# EAGLE schematic Domino Qi Mini No Teardrop (EAGLE 6.5.0)
Domino breakout Board
DATABASE: ./../Common/BOM/Domino_DB.txt; DRAWN: M.STEMPIN; REV: C
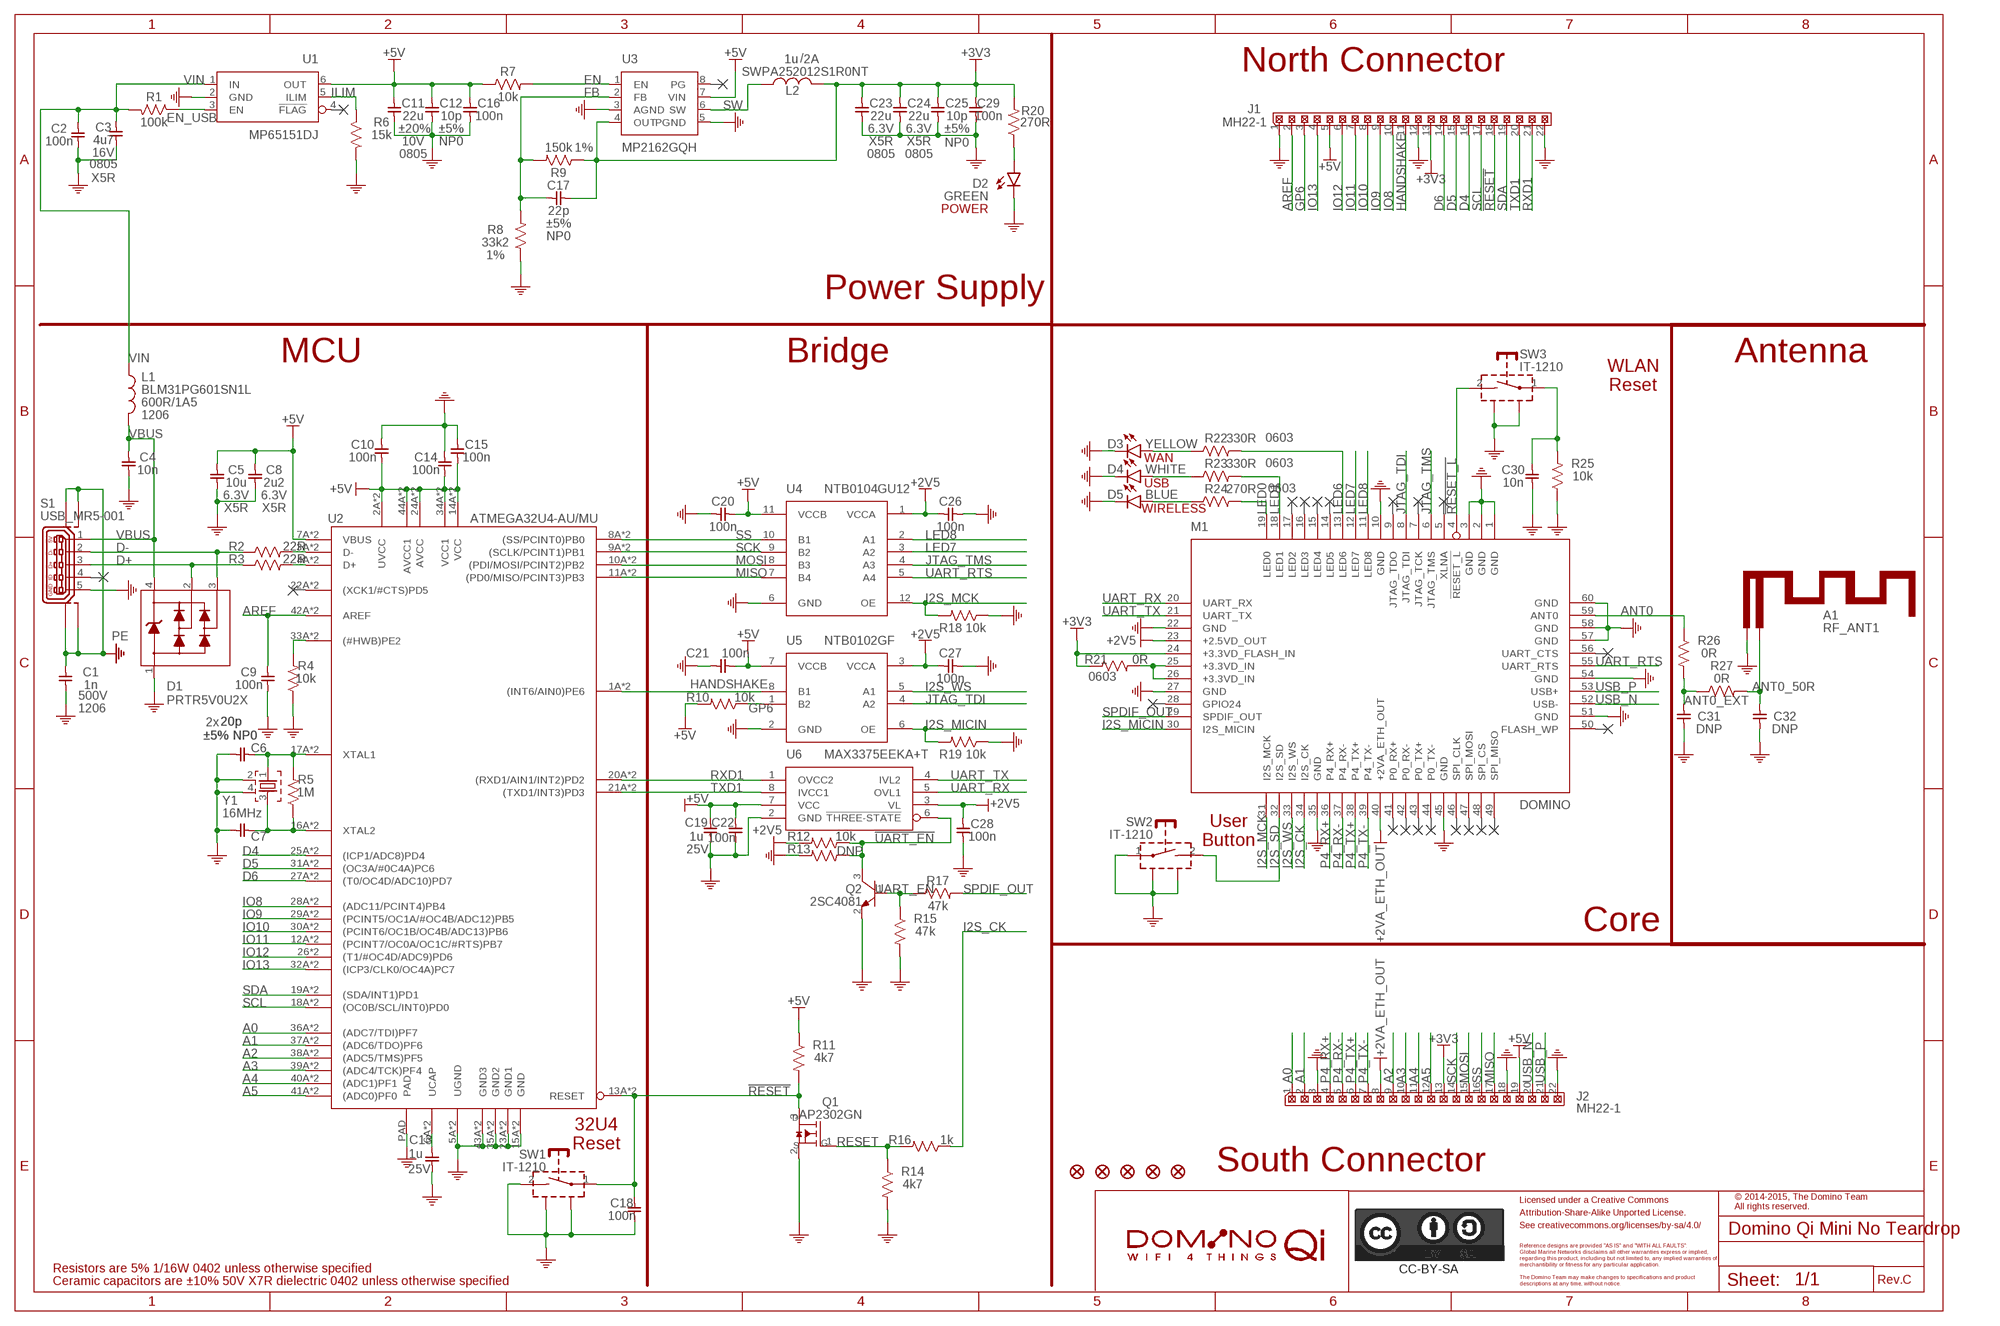
[diagram p0: schematic, sheet 1]
PORT1 (NC): BOM: EXCLUDE
PORT2 (NC): BOM: EXCLUDE
PORT3 (NC): BOM: EXCLUDE
PORT5 (NC): BOM: EXCLUDE
PORT6 (NC): BOM: EXCLUDE
PORT7 (NC): BOM: EXCLUDE
PORT8 (NC): BOM: EXCLUDE
PORT9 (NC): BOM: EXCLUDE
PORT10 (NC): BOM: EXCLUDE
PORT11 (NC): BOM: EXCLUDE
PORT12 (NC): BOM: EXCLUDE
PORT13 (NC): BOM: EXCLUDE
PORT14 (NC): BOM: EXCLUDE
PORT15 (NC): BOM: EXCLUDE
PORT16 (NC): BOM: EXCLUDE
PORT17 (NC): BOM: EXCLUDE
PORT18 (NC): BOM: EXCLUDE
PORT19 (NC): BOM: EXCLUDE
PORT20 (NC): BOM: EXCLUDE
PORT21 (NC): BOM: EXCLUDE
PORT22 (NC): BOM: EXCLUDE
PORT23 (NC): BOM: EXCLUDE

## Parts
A1  RF_ANT1  [RF_ANT1]
C1  1n  CAP_1206  [C1206]
C2  100n  CAP_0402  [C0402]
C3  4u7  CAP_0805  [C0805]
C4  10n  CAP_0402  [C0402]
C5  10u  CAP_0402  [C0402]
C6  20p  CAP_0402  [C0402]
C7  20p  CAP_0402  [C0402]
C8  2u2  CAP_0805  [C0805]
C9  100n  CAP_0402  [C0402]
C10  100n  CAP_0402  [C0402]
C11  22u  CAP_0805  [C0805]
C12  10p  CAP_0402  [C0402]
C13  1u  CAP_0402  [C0402]
C14  100n  CAP_0402  [C0402]
C15  100n  CAP_0402  [C0402]
C16  100n  CAP_0402  [C0402]
C17  22p  CAP_0402  [C0402]
C18  100n  CAP_0402  [C0402]
C19  1u  CAP_0402  [C0402]
C20  100n  CAP_0402  [C0402]
C21  100n  CAP_0402  [C0402]
C22  100n  CAP_0402  [C0402]
C23  22u  CAP_0805  [C0805]
C24  22u  CAP_0805  [C0805]
C25  10p  CAP_0402  [C0402]
C26  100n  CAP_0402  [C0402]
C27  100n  CAP_0402  [C0402]
C28  100n  CAP_0402  [C0402]
C29  100n  CAP_0402  [C0402]
C30  10n  CAP_0402  [C0402]
C31  DNP  CAP_0402  [C0402]
C32  DNP  CAP_0402  [C0402]
CC-BY-SA  CC-BY-SA_LOGO  [CC-BY-SA_LOGO]
D1  PRTR5V0U2X  [SOT143B]
D2  GREEN  LED_0402  [LED0402]
D3  YELLOW  LED_0402  [LED0402]
D4  WHITE  LED_0402  [LED0402]
D5  BLUE  LED_0402  [LED0402]
F1  FIDUCIAL  [FIDUCIAL]
F2  FIDUCIAL  [FIDUCIAL]
F3  FIDUCIAL  [FIDUCIAL]
F4  FIDUCIAL  [FIDUCIAL]
F5  FIDUCIAL  [FIDUCIAL]
J1  MH22-1  [MH22-1-0.1]
J2  MH22-1  [MH22-1-0.1]
L1  BLM31PG601SN1L  FB_1206  [FB1206]
L2  SWPA252012S1R0NT  [SWPA252012S]
M1  DOMINO  [DOMINO]
Q1  AP2302GN  [SOT23-3]
Q2  2SC4081  [SOT323]
R1  100k  RES_0402  [R0402]
R2  22R  RES_0402  [R0402]
R3  22R  RES_0402  [R0402]
R4  10k  RES_0402  [R0402]
R5  1M  RES_0402  [R0402]
R6  15k  RES_0402  [R0402]
R7  10k  RES_0402  [R0402]
R8  33k2  RES_0402  [R0402]
R9  150k  RES_0402  [R0402]
R10  10k  RES_0402  [R0402]
R11  4k7  RES_0402  [R0402]
R12  10k  RES_0402  [R0402]
R13  10k  RES_0402  [R0402]
R14  4k7  RES_0402  [R0402]
R15  47k  RES_0402  [R0402]
R16  1k  RES_0402  [R0402]
R17  47k  RES_0402  [R0402]
R18  10k  RES_0402  [R0402]
R19  10k  RES_0402  [R0402]
R20  270R  RES_0402  [R0402]
R21  0R  RES_0603  [R0603]
R22  330R  RES_0603  [R0603]
R23  330R  RES_0603  [R0603]
R24  270R  RES_0603  [R0603]
R25  10k  RES_0402  [R0402]
R26  0R  RES_0402  [R0402]
R27  0R  RES_0402  [R0402]
S1  USB_MR5-001  [USB-MR5-001]
SW1  IT-1210  [IT-1210]
SW2  IT-1210  [IT-1210]
SW3  IT-1210  [IT-1210]
U1  MP65151DJ  [SOT23-6]
U2  ATMEGA32U4-AU/MU  [ATMEGA32U4_DUAL_FOOTPRINT]
U3  MP2162GQH  [QFN-8_2X1.5]
U4  NTB0104GU12  [XQFN-12]
U5  NTB0102GF  [SOT1089]
U6  MAX3375EEKA+T  [SOT23-8]
W1  DOMINO_QI_LOGO  [DOMINO_QI_LOGO]
Y1  16MHz  CRYSTAL_2SH  [CRYSTAL_32X25]

## Nets
!RESET: C18.1 J1.18 Q1.3(D) R11.2 SW1.1 U2.13A(RESET) U2.13M(RESET)
!RESET_L: M1.4(!RESET_L) SW3.2
!UART_EN: Q2.3(C) R12.1 R13.1 U6.6(!THREE-STATE)
+2V5: C26.1 C27.1 C28.1 M1.23(+2.5VD_OUT) R12.2 U4.1(VCCA) U5.3(VCCA) U6.3(VL)
+2VA_ETH_OUT [Ethernet]: J2.8 M1.40(+2VA_ETH_OUT)
+3.3VD_IN: M1.25(+3.3VD_IN) M1.26(+3.3VD_IN) R21.2
+3V3: C17.2 C23.1 C24.1 C25.1 C29.1 J1.13 J2.13 L2.2 M1.24(+3.3VD_FLASH_IN) R9.1 R20.2 R21.1 U3.4(OUT)
+5V: C5.1 C8.1 C10.1 C11.1 C12.1 C14.1 C15.1 C16.1 C19.2 C20.1 C21.1 C22.1 J1.5 J2.19 R7.1 R10.2 R11.1 U1.6(OUT) U2.2A(UVCC) U2.2M(UVCC) U2.7A(VBUS) U2.7M(VBUS) U2.14A(VCC) U2.14M(VCC) U2.24A(AVCC) U2.24M(AVCC) U2.34A(VCC1) U2.34M(VCC1) U2.44A(AVCC1) U2.44M(AVCC1) U3.7(VIN) U4.11(VCCB) U5.7(VCCB) U6.7(VCC)
A0: J2.1 U2.36A((ADC7/TDI)PF7) U2.36M((ADC7/TDI)PF7)
A1: J2.2 U2.37A((ADC6/TDO)PF6) U2.37M((ADC6/TDO)PF6)
A2: J2.9 U2.38A((ADC5/TMS)PF5) U2.38M((ADC5/TMS)PF5)
A3: J2.10 U2.39A((ADC4/TCK)PF4) U2.39M((ADC4/TCK)PF4)
A4: J2.11 U2.40A((ADC1)PF1) U2.40M((ADC1)PF1)
A5: J2.12 U2.41A((ADC0)PF0) U2.41M((ADC0)PF0)
ANT0 [RF]: M1.59(ANT0) R26.1
ANT0_50R: A1.FEED C32.1 R27.2
ANT0_EXT [RF]: C31.1 R26.2 R27.1
AREF: C9.1 J1.2 U2.42A(AREF) U2.42M(AREF)
BLUE_LED: D5.2(A) R24.1
BLUE_LED1: D4.2(A) R23.1
BLUE_LED2: D3.2(A) R22.1
D4: J1.16 U2.25A((ICP1/ADC8)PD4) U2.25M((ICP1/ADC8)PD4)
D5: J1.15 U2.31A((OC3A/#0C4A)PC6) U2.31M((OC3A/#0C4A)PC6)
D6: J1.14 U2.27A((T0/OC4D/ADC10)PD7) U2.27M((T0/OC4D/ADC10)PD7)
D+ [USB]: D1.2 R3.1 S1.3
D- [USB]: D1.3 R2.1 S1.2
EN: R7.2 U3.1(EN)
EN_USB: R1.1 U1.3(EN)
FB: C17.1 R8.2 R9.2 U3.2(FB)
GND: A1.GND C1.2 C2.2 C3.2 C4.2 C5.2 C6.1 C7.1 C8.2 C9.2 C10.2 C11.2 C12.2 C13.1 C14.2 C15.2 C16.2 C18.2 C19.1 C20.2 C21.2 C22.2 C23.2 C24.2 C25.2 C26.2 C27.2 C28.2 C29.2 C30.2 C31.2 C32.2 D1.1 D2.1(C) D3.1(C) D4.1(C) D5.1(C) J1.1 J1.12 J1.22 J2.3 J2.18 J2.22 M1.1(GND) M1.2(GND) M1.3(GND) M1.10(GND) M1.22(GND) M1.27(GND) M1.35(GND) M1.45(GND) M1.51(GND) M1.54(GND) M1.57(GND) M1.58(GND) M1.60(GND) Q1.2(S) Q2.2(E) R4.1 R6.2 R8.1 R13.2 R14.2 R15.2 R18.1 R19.1 R25.1 S1.5 SW1.2 SW1.SH$1 SW1.SH$2 SW2.1 SW2.SH$1 SW2.SH$2 SW3.SH$1 SW3.SH$2 U1.2(GND) U2.5A(UGND) U2.5M(UGND) U2.15A(GND) U2.15M(GND) U2.23A(GND1) U2.23M(GND1) U2.35A(GND2) U2.35M(GND2) U2.43A(GND3) U2.43M(GND3) U2.PAD U3.3(AGND) U3.5(PGND) U4.6(GND) U5.2(GND) U6.2(GND) Y1.2 Y1.4
GP6: J1.3 R10.1 U5.1(B2)
HANDSHAKE: J1.11 U2.1A((INT6/AIN0)PE6) U2.1M((INT6/AIN0)PE6) U5.8(B1)
I2S_CK: M1.34(I2S_CK) R16.1
I2S_MCK: M1.31(I2S_MCK) R18.2 U4.12(OE)
I2S_MICIN: M1.30(I2S_MICIN) R19.2 U5.6(OE)
I2S_SD: M1.32(I2S_SD) SW2.2
I2S_WS: M1.33(I2S_WS) U5.5(A1)
ILIM: R6.1 U1.5(ILIM)
IO8: J1.10 U2.28A((ADC11/PCINT4)PB4) U2.28M((ADC11/PCINT4)PB4)
IO9: J1.9 U2.29A((PCINT5/OC1A/#OC4B/ADC12)PB5) U2.29M((PCINT5/OC1A/#OC4B/ADC12)PB5)
IO10: J1.8 U2.30A((PCINT6/OC1B/OC4B/ADC13)PB6) U2.30M((PCINT6/OC1B/OC4B/ADC13)PB6)
IO11: J1.7 U2.12A((PCINT7/OC0A/OC1C/#RTS)PB7) U2.12M((PCINT7/OC0A/OC1C/#RTS)PB7)
IO12: J1.6 U2.26((T1/#OC4D/ADC9)PD6) U2.26M((T1/#OC4D/ADC9)PD6)
IO13: J1.4 U2.32A((ICP3/CLK0/OC4A)PC7) U2.32M((ICP3/CLK0/OC4A)PC7)
JTAG_TDI: M1.8(JTAG_TDI) U5.4(A2)
JTAG_TMS: M1.6(JTAG_TMS) U4.4(A3)
LED0: M1.19(LED0) R24.2
LED1: M1.18(LED1) R23.2
LED6: M1.13(LED6) R22.2
LED7: M1.12(LED7) U4.3(A2)
LED8: M1.11(LED8) U4.2(A1)
MISO: J2.17 U2.11A((PD0/MISO/PCINT3)PB3) U2.11M((PD0/MISO/PCINT3)PB3) U4.7(B4)
MOSI: J2.15 U2.10A((PDI/MOSI/PCINT2)PB2) U2.10M((PDI/MOSI/PCINT2)PB2) U4.8(B3)
N$5: R2.2 U2.3A(D-) U2.3M(D-)
N$8: R4.2 U2.33A((#HWB)PE2) U2.33M((#HWB)PE2)
N$9: R3.2 U2.4A(D+) U2.4M(D+)
P4_RX+: J2.4 M1.36(P4_RX+)
P4_RX-: J2.5 M1.37(P4_RX-)
P4_TX+: J2.6 M1.38(P4_TX+)
P4_TX-: J2.7 M1.39(P4_TX-)
PE: C1.1 S1.SH$1(M0) S1.SH$2(M1) S1.SH$3(M2) S1.SH$4(M3)
POWER_LED: D2.2(A) R20.1
RESET: Q1.1(G) R14.1 R16.2
RESET_SWITCH: C30.1 R25.2 SW3.1
RXD1: J1.21 U2.20A((RXD1/AIN1/INT2)PD2) U2.20M((RXD1/AIN1/INT2)PD2) U6.1(OVCC2)
SCK: J2.14 U2.9A((SCLK/PCINT1)PB1) U2.9M((SCLK/PCINT1)PB1) U4.9(B2)
SCL: J1.17 U2.18A((OC0B/SCL/INT0)PD0) U2.18M((OC0B/SCL/INT0)PD0)
SDA: J1.19 U2.19A((SDA/INT1)PD1) U2.19M((SDA/INT1)PD1)
SPDIF_OUT: M1.29(SPDIF_OUT) R17.2
SS: J2.16 U2.8A((SS/PCINT0)PB0) U2.8M((SS/PCINT0)PB0) U4.10(B1)
SW: L2.1 U3.6(SW)
TXD1: J1.20 U2.21A((TXD1/INT3)PD3) U2.21M((TXD1/INT3)PD3) U6.8(IVCC1)
UART_EN: Q2.1(B) R15.1 R17.1
UART_RTS: M1.55(UART_RTS) U4.5(A4)
UART_RX: M1.20(UART_RX) U6.5(OVL1)
UART_TX: M1.21(UART_TX) U6.4(IVL2)
UCAP: C13.2 U2.6A(UCAP) U2.6M(UCAP)
USB_N [USB]: J2.20 M1.52(USB-)
USB_P [USB]: J2.21 M1.53(USB+)
VBUS: C4.1 D1.4 L1.2 S1.1
VIN: C2.1 C3.1 L1.1 R1.2 U1.1(IN)
XTAL1: C6.2 R5.2 U2.17A(XTAL1) U2.17M(XTAL1) Y1.1
XTAL2: C7.2 R5.1 U2.16A(XTAL2) U2.16M(XTAL2) Y1.3
Unconnected: M1.5(XLNA) M1.7(JTAG_TCK) M1.9(JTAG_TDO) M1.14(LED5) M1.15(LED4) M1.16(LED3) M1.17(LED2) M1.28(GPIO24) M1.41(P0_RX+) M1.42(P0_RX-) M1.43(P0_TX+) M1.44(P0_TX-) M1.46(SPI_CLK) M1.47(SPI_MOSI) M1.48(SPI_CS) M1.49(SPI_MISO) M1.50(FLASH_WP) M1.56(UART_CTS) S1.4 U1.4(!FLAG) U2.22A((XCK1/#CTS)PD5) U2.22M((XCK1/#CTS)PD5) U3.8(PG)

## Notes on the sheet
- /
- North Connector
- POWER
- Power Supply
- MCU | Bridge | Antenna
- WLAN
  Reset
- WAN
- USB
- WIRELESS
- 2x
- User
  Button
- Core
- 32U4
  Reset
- South Connector
- Licensed under a Creative Commons
- © 2014-2015, The Domino Team
  All rights reserved.
- Attribution-Share-Alike Unported License.
- See creativecommons.org/licenses/by-sa/4.0/
- Reference designs are provided "AS IS" and "WITH ALL FAULTS".
- Global Marine Networks disclaims all other warranties express or implied,
- regarding this product, including but not limited to, any implied warranties of
- merchantibility or fitness for any particular application.
- Resistors are 5% 1/16W 0402 unless otherwise specified
- The Domino Team may make changes to specifications and product
- Ceramic capacitors are ±10% 50V X7R dielectric 0402 unless otherwise specified | descriptions at any time, without notice. | Rev.

## Library data of the parts
A1 = Domino:RF_ANT1: 2.4 GHz PCB WiFi Antenna; BOM: EXCLUDE; PARTNO: RF_ANT1
C1 = Domino:CAP_: Capacitor; PARTNO: C1206_1n_X7R_10%_CER_500V; SIZE: 1206; TC: X7R; TOL: ±10%; TYPE: CER; VOLT: 500V
C2 C9 C10 C14-C16 C18 C20-C22 C26-C29 = Domino:CAP_: Capacitor; PARTNO: C0402_100n_X7R_10%_CER_50V; SIZE: 0402; TC: X7R; TOL: ±10%; TYPE: CER; VOLT: 50V
C3 = Domino:CAP_: Capacitor; PARTNO: C0805_4u7_X5R_10%_CER_16V; SIZE: 0805; TC: X5R; TOL: ±10%; TYPE: CER; VOLT: 16V
C4 C30 = Domino:CAP_: Capacitor; PARTNO: C0402_10n_X7R_10%_CER_50V; SIZE: 0402; TC: X7R; TOL: ±10%; TYPE: CER; VOLT: 50V
C5 = Domino:CAP_: Capacitor; PARTNO: C0402_10u_X5R_10%_CER_6V3; SIZE: 0402; TC: X5R; TOL: ±10%; TYPE: CER; VOLT: 6.3V
C6 C7 = Domino:CAP_: Capacitor; PARTNO: C0402_20p_NP0_5%_CER_50V; SIZE: 0402; TC: NP0; TOL: ±5%; TYPE: CER; VOLT: 50V
C8 = Domino:CAP_: Capacitor; PARTNO: C0402_2u2_X5R_10%_CER_6V3; SIZE: 0402; TC: X5R; TOL: ±10%; TYPE: CER; VOLT: 6.3V
C11 = Domino:CAP_: Capacitor; PARTNO: C1206_22u_X7R_20%_CER_10V; SIZE: 0805; TC: X7R; TOL: ±20%; TYPE: CER; VOLT: 10V
C12 C25 = Domino:CAP_: Capacitor; PARTNO: C0402_10p_NP0_5%_CER_50V; SIZE: 0402; TC: NP0; TOL: ±5%; TYPE: CER; VOLT: 50V
C13 C19 = Domino:CAP_: Capacitor; PARTNO: C0402_1u_X7R_10%_CER_25V; SIZE: 0402; TC: X7R; TOL: ±10%; TYPE: CER; VOLT: 25V
C17 = Domino:CAP_: Capacitor; PARTNO: C0402_22p_NP0_5%_CER_50V; SIZE: 0402; TC: NP0; TOL: ±5%; TYPE: CER; VOLT: 50V
C23 C24 = Domino:CAP_: Capacitor; PARTNO: C0805_22u_X5R_20%_CER_6V3; SIZE: 0805; TC: X5R; TOL: ±20%; TYPE: CER; VOLT: 6.3V
C31 C32 = Domino:CAP_: Capacitor; DNP: T; PARTNO: C0402_DNP; SIZE: 0402
CC-BY-SA = Domino:CC-BY-SA_LOGO: Attribution-Share-Alike Unported License See creativecommons.org/licenses/by-sa/3.0/ for details.; BOM: EXCLUDE
D1 = Domino:PRTR5V0U2X: Ultra low capacitance double rail-to-rail ESD protection diode; PARTNO: PRTR5V0U2X; RATE: 300W; VOLT: 5V
D2 = Domino:LED_: LED; PARTNO: LED0603-GREEN
D3 = Domino:LED_: LED; PARTNO: LED0603-YELLOW
D4 = Domino:LED_: LED; PARTNO: LED0603-WHITE
D5 = Domino:LED_: LED; PARTNO: LED0603-BLUE
F1-F5 = Domino:FIDUCIAL: Fiducial Mark; BOM: EXCLUDE
J1 J2 = Domino:MH22-1: 22x1 Pin Male Header; PARTNO: MH22-1-0.1
L1 = Domino:FB_: Ferrite Bead; OPT: 600R/1A5; PARTNO: BLM31PG601SN1L; SIZE: 1206
L2 = Domino:SWPA252012S*?: 2.0 x 1.5 mm Footprint 1.2mm Height Shielded Inductor; INDUCTANCE: 1u; PARTNO: SWPA252012SMT; RATE: 2A; TOL: ±30%
M1 = Domino:DOMINO: GL-Connect Domino WiFi Module; PARTNO: DOMINO-CORE
Q1 = Domino:AP2302GN: N-Channel Enhancement Mode Power MOSFET; PARTNO: AP2302GN
Q2 = Domino:2SC4081: General Purpose NPN Transistor (50V, 0.15A); PARTNO: 2SC4081
R1 = Domino:RES_: Resistor; PARTNO: R0402_100k_5%_62.5mW; RATE: 62.5mW; SIZE: 0402; TOL: 5%
R2 R3 = Domino:RES_: Resistor; PARTNO: R0402_22R_5%_62.5mW; RATE: 62.5mW; SIZE: 0402; TOL: 5%
R4 R7 R10 R12 R18 R19 R25 = Domino:RES_: Resistor; PARTNO: R0402_10k_5%_62.5mW; RATE: 62.5mW; SIZE: 0402; TOL: 5%
R5 = Domino:RES_: Resistor; PARTNO: R0402_1M_5%_62.5mW; RATE: 62.5mW; SIZE: 0402; TOL: 5%
R6 = Domino:RES_: Resistor; PARTNO: R0402_15k_5%_62.5mW; RATE: 62.5mW; SIZE: 0402; TOL: 5%
R8 = Domino:RES_: Resistor; PARTNO: R0402_33k2_1%_62.5mW; RATE: 62.5mW; SIZE: 0402; TOL: 1%
R9 = Domino:RES_: Resistor; PARTNO: R0402_150k_1%_62.5mW; RATE: 62.5mW; SIZE: 0402; TOL: 1%
R11 R14 = Domino:RES_: Resistor; PARTNO: R0402_4k7_5%_62.5mW; RATE: 62.5mW; SIZE: 0402; TOL: 5%
R13 = Domino:RES_: Resistor; DNP: T; PARTNO: R0402_10k_5%_62.5mW; RATE: 62.5mW; SIZE: 0402; TOL: 5%
R15 R17 = Domino:RES_: Resistor; PARTNO: R0402_47k_5%_62.5mW; RATE: 62.5mW; SIZE: 0402; TOL: 5%
R16 = Domino:RES_: Resistor; PARTNO: R0402_1k_5%_62.5mW; RATE: 62.5mW; SIZE: 0402; TOL: 5%
R20 = Domino:RES_: Resistor; PARTNO: R0402_270R_5%_62.5mW; RATE: 62.5mW; SIZE: 0402; TOL: 5%
R21 = Domino:RES_: Resistor; PARTNO: R0603_0R_5%_125mW; RATE: 125mW; SIZE: 0603; TOL: 5%
R22 R23 = Domino:RES_: Resistor; PARTNO: R0603_330R_5%_125mW; RATE: 125mW; SIZE: 0603; TOL: 5%
R24 = Domino:RES_: Resistor; PARTNO: R0603_270R_5%_125mW; RATE: 125mW; SIZE: 0603; TOL: 5%
R26 R27 = Domino:RES_: Resistor; PARTNO: R0402_0R_5%_62.5mW; RATE: 62.5mW; SIZE: 0402; TOL: 5%
S1 = Domino:USB_MR5-001: Micro USB Type B Receptacle, 4 Shield Pins SMT; PARTNO: USB MR5-003A
SW1-SW3 = Domino:IT-1210: Tact Switch SPST, 2 Contacts, 2 Shield Pins; PARTNO: IT-1210
U1 = Domino:MP65151DJ: Precision 60mA-1.7A Programmable Current-Limited Power Distribution Switch; PARTNO: MP65151DJ
U2 = Domino:ATMEGA32U4-: 8-bit AVR Microcontroller with 32K Bytes of ISP Flash and USB Controller; PARTNO: ATMEGA32U4-MU
U3 = Domino:MP2162: 2A, 6V, 1.5MHz Synchronous Step-Down Switcher; PARTNO: MP2162GQH
U4 = Domino:NTB0104: Dual supply translating transceiver; auto direction sensing; 3-state; PARTNO: NTB0104GU12
U5 = Domino:NTB0102: Dual supply translating transceiver; auto direction sensing; 3-state; PARTNO: NTB0102GF
U6 = Domino:MAX3375E: Dual Low-Voltage Level Translators; PARTNO: MAX3375EEKA+T
W1 = Domino:DOMINO_QI_LOGO: Domino Qi Logo; BOM: EXCLUDE
Y1 = Domino:CRYSTAL_2SH: Crystal with 2 Shield Pins; PARTNO: CRYSTAL_16MHZ_32X25_2SH_12PF_30PPM

## Net classes
1 USB: width 0.368 mm, clearance 0.152 mm to class 0, clearance 0.152 mm
2 RF: width 0.66 mm, clearance 0.152 mm
3 Ethernet: width 0.254 mm, clearance 0.152 mm to class 0, clearance 0.152 mm to class 1, clearance 0.152 mm to class 2, clearance 0.152 mm